# EAGLE design odroid_platine_nerdbot (EAGLE 8.0.1)
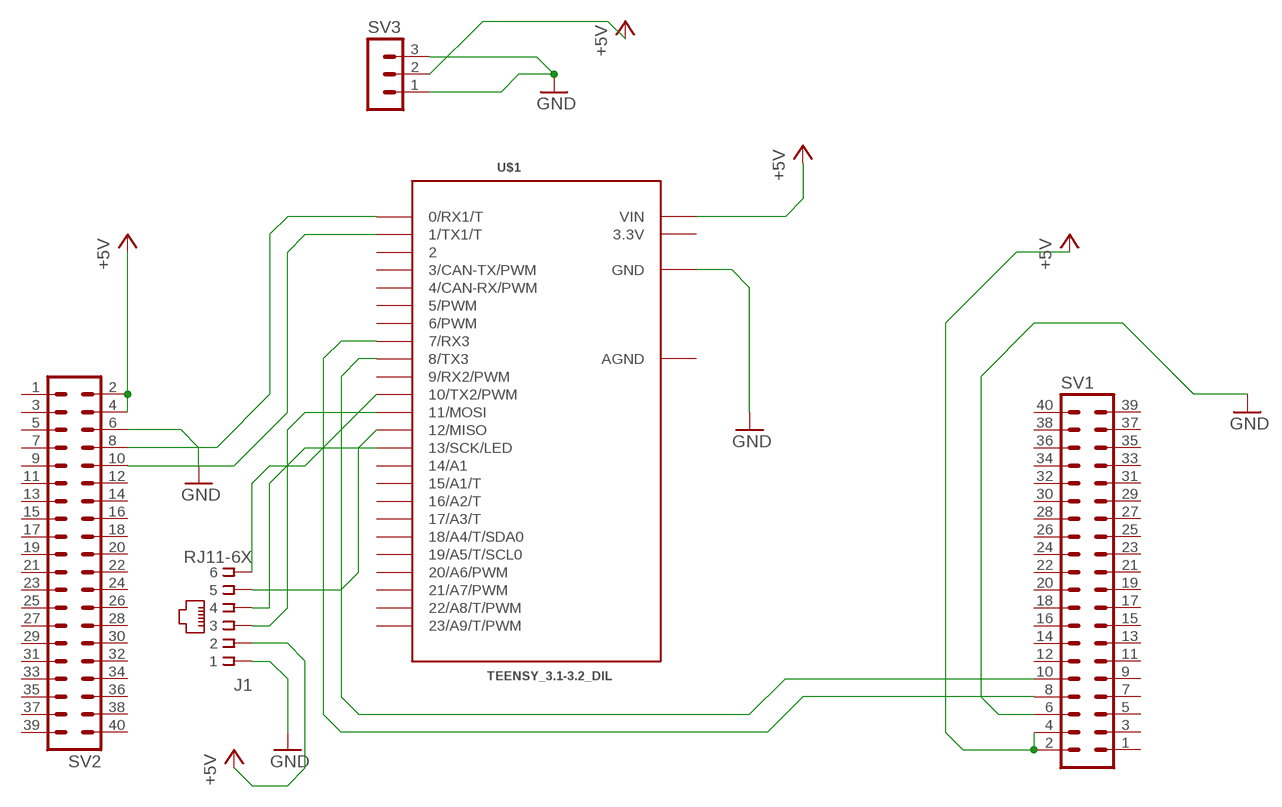
[diagram p0: schematic, sheet 1]

## Parts
J1  RJ11-6X  [RJ11-NO_SHIELD]
SV1  MA20-2  [MA20-2]
SV2  MA20-2  [MA20-2]
SV3  MA03-1  [MA03-1]
U$1  TEENSY_3.1-3.2_DIL  [TEENSY_3.0-3.2&LC_DIL]

## Nets
+5V: J1.2 SV1.2 SV1.4 SV2.2 SV2.4 SV3.2 U$1.VIN
GND: J1.1 SV1.6 SV2.6 SV3.1 SV3.3 U$1.GND
N$1: SV2.8 U$1.0(0/RX1/T)
N$2: SV2.10 U$1.1(1/TX1/T)
N$4: SV1.8 U$1.7(7/RX3)
N$5: SV1.10 U$1.8(8/TX3)
N$6: J1.3 U$1.11(11/MOSI)
N$7: J1.4 U$1.13(13/SCK/LED)
N$8: J1.5 U$1.12(12/MISO)
N$9: J1.6 U$1.10(10/TX2/PWM)
Unconnected: SV1.1 SV1.3 SV1.5 SV1.7 SV1.9 SV1.11 SV1.12 SV1.13 SV1.14 SV1.15 SV1.16 SV1.17 SV1.18 SV1.19 SV1.20 SV1.21 SV1.22 SV1.23 SV1.24 SV1.25 SV1.26 SV1.27 SV1.28 SV1.29 SV1.30 SV1.31 SV1.32 SV1.33 SV1.34 SV1.35 SV1.36 SV1.37 SV1.38 SV1.39 SV1.40 SV2.1 SV2.3 SV2.5 SV2.7 SV2.9 SV2.11 SV2.12 SV2.13 SV2.14 SV2.15 SV2.16 SV2.17 SV2.18 SV2.19 SV2.20 SV2.21 SV2.22 SV2.23 SV2.24 SV2.25 SV2.26 SV2.27 SV2.28 SV2.29 SV2.30 SV2.31 SV2.32 SV2.33 SV2.34 SV2.35 SV2.36 SV2.37 SV2.38 SV2.39 SV2.40 U$1.2 U$1.3(3/CAN-TX/PWM) U$1.4(4/CAN-RX/PWM) U$1.5(5/PWM) U$1.6(6/PWM) U$1.9(9/RX2/PWM) U$1.14/A0(14/A1) U$1.15/A1(15/A1/T) U$1.16/A2(16/A2/T) U$1.17/A3(17/A3/T) U$1.18/A4(18/A4/T/SDA0) U$1.19/A5(19/A5/T/SCL0) U$1.20/A6(20/A6/PWM) U$1.21/A7(21/A7/PWM) U$1.22/A8(22/A8/T/PWM) U$1.23/A9(23/A9/T/PWM)

## Power pins joined to a net without a drawn wire
3.3V: U$1.3.3V
AGND: U$1.AGND

## Library data of the parts
J1 = con-tycoelectronics:RJ11: CORCOM Modular RJ Jacks No Shield Source: www.tycoelectronics.com .. ENG_DS_1654001_1099_RJ_L_0507.pdf; MPN: RJ11-6X; OC_FARNELL: unknown; OC_NEWARK: 16R6089
SV1 SV2 = con-lstb:MA20-2: PIN HEADER; OC_FARNELL: unknown; OC_NEWARK: unknown
SV3 = con-lstb:MA03-1: PIN HEADER; OC_FARNELL: unknown; OC_NEWARK: unknown
U$1 = Teensy_3_and_LC_Series_Boards_v1.4:TEENSY_3.1-3.2_DIL: Teensy 3.1 or 3.2 in a DIL Layout.

## Board
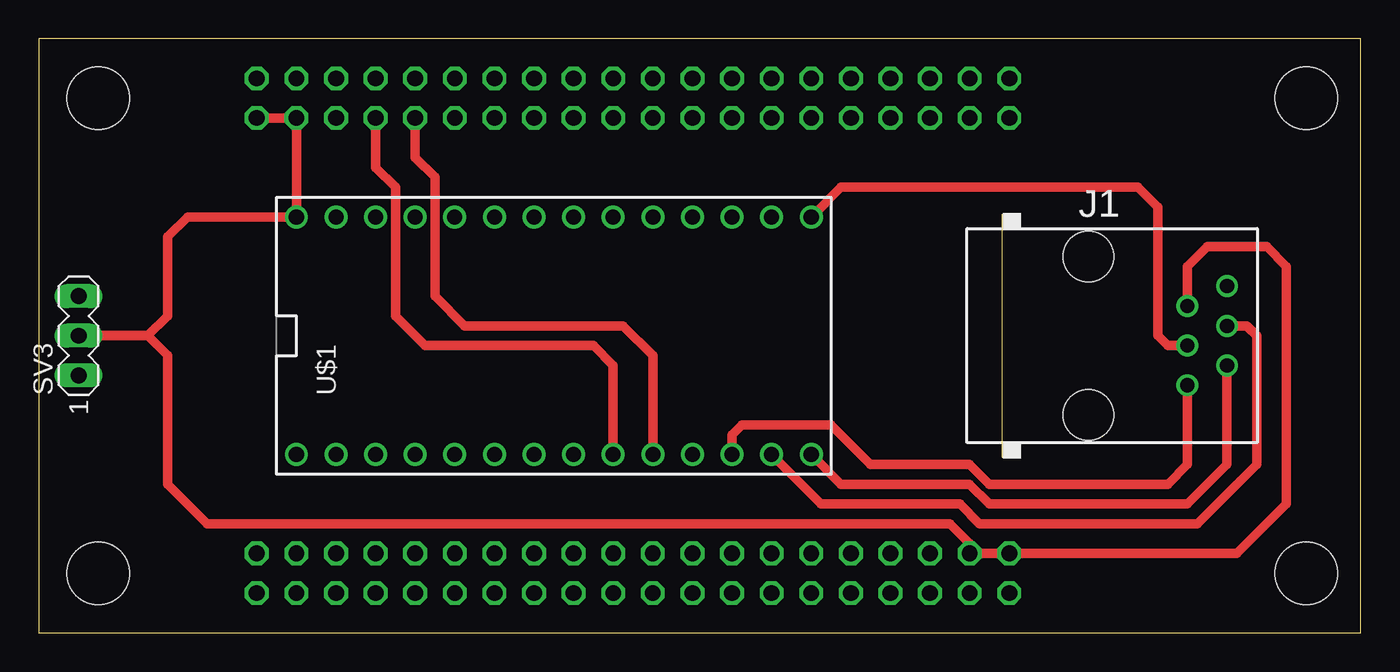
[diagram p1: board, top side]
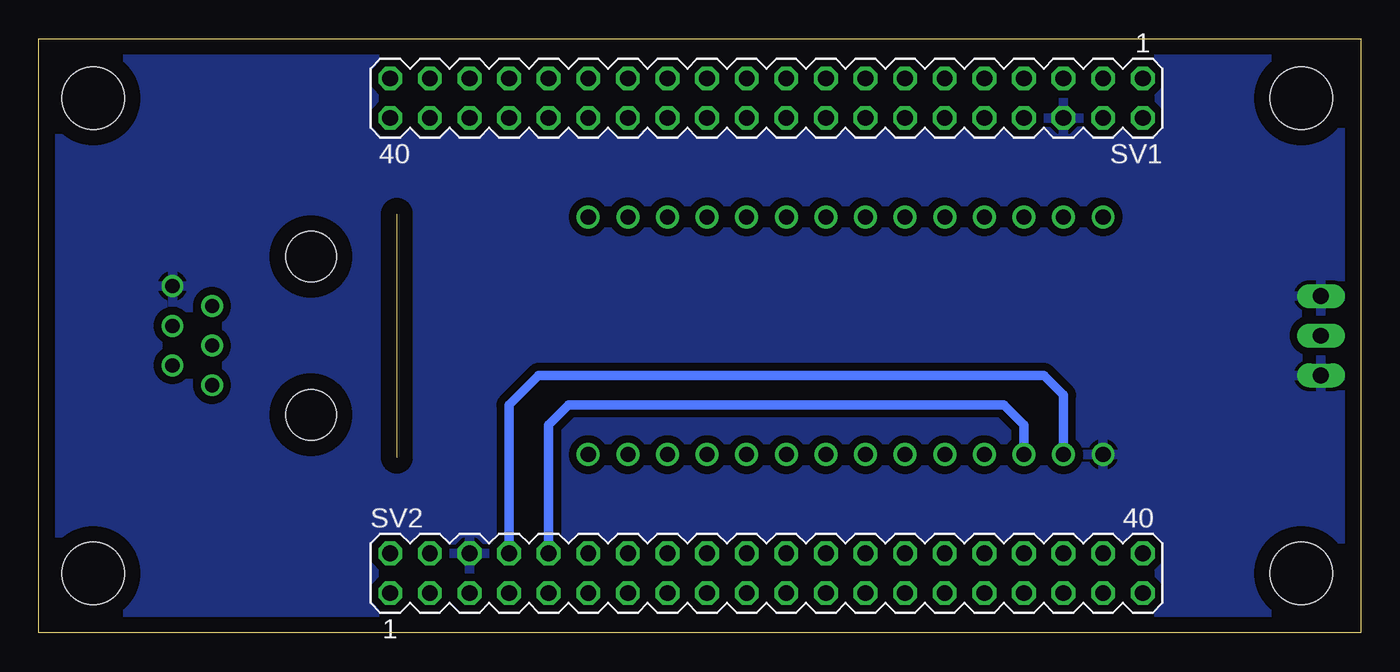
[diagram p2: board, bottom side, seen from below]

Size 84.76 x 38.09 mm. Coordinates in mm from the lower left corner, seen from the top.
Outline: 0,0 84.76,0 84.76,38.09 0,38.09 0,0
Copper layers (1*16): Top 0.035mm / dielectric 1.5mm / Bottom 0.035mm
Design rules "default": minimum track width 10mil, minimum drill 24mil, track to track 8mil, track to pad 8mil, pad to pad 8mil, via to via 8mil, smd to smd 8mil, copper to edge 40mil, drill to drill 8mil, minimum pad ring 10mil, minimum via ring 8mil, stop-mask expansion 4mil, vias tented up to drill 0mil, thermal gap 10mil
Holes 4 mm at 3.81,34.29 3.81,3.81 81.28,34.29 81.28,3.81

### Footprints (pad centres in the part's own frame; a part is rotated, then mirrored left to right if it is on the bottom)
RJ11-NO_SHIELD = drill 0.9 pad 1.4: 1 -3.175,8.89; 2 -1.905,6.35; 3 -0.635,8.89; 4 0.635,6.35; 5 1.905,8.89; 6 3.175,6.35 | hole 3.251: -5.08,0; 5.08,0
MA20-2 = drill 1.016 octagon: 1 -24.13,-1.27; 2 -24.13,1.27; 3 -21.59,-1.27; 4 -21.59,1.27; 5 -19.05,-1.27; 6 -19.05,1.27; 7 -16.51,-1.27; 8 -16.51,1.27; 9 -13.97,-1.27; 10 -13.97,1.27; 11 -11.43,-1.27; 12 -11.43,1.27; 13 -8.89,-1.27; 14 -8.89,1.27; 15 -6.35,-1.27; 16 -6.35,1.27; 17 -3.81,-1.27; 18 -3.81,1.27; 19 -1.27,-1.27; 20 -1.27,1.27; 21 1.27,-1.27; 22 1.27,1.27; 23 3.81,-1.27; 24 3.81,1.27; 25 6.35,-1.27; 26 6.35,1.27; 27 8.89,-1.27; 28 8.89,1.27; 29 11.43,-1.27; 30 11.43,1.27; 31 13.97,-1.27; 32 13.97,1.27; 33 16.51,-1.27; 34 16.51,1.27; 35 19.05,-1.27; 36 19.05,1.27; 37 21.59,-1.27; 38 21.59,1.27; 39 24.13,-1.27; 40 24.13,1.27
MA03-1 = drill 1.016 long: 1 -2.54,0; 2 0,0; 3 2.54,0
TEENSY_3.0-3.2&LC_DIL = drill 0.965: 0 -7.62,13.97; 1 -7.62,11.43; 2 -7.62,8.89; 3 -7.62,6.35; 3.3V 7.62,11.43; 4 -7.62,3.81; 5 -7.62,1.27; 6 -7.62,-1.27; 7 -7.62,-3.81; 8 -7.62,-6.35; 9 -7.62,-8.89; 10 -7.62,-11.43; 11 -7.62,-13.97; 12 -7.62,-16.51; 13 7.62,-16.51; 14/A0 7.62,-13.97; 15/A1 7.62,-11.43; 16/A2 7.62,-8.89; 17/A3 7.62,-6.35; 18/A4 7.62,-3.81; 19/A5 7.62,-1.27; 20/A6 7.62,1.27; 21/A7 7.62,3.81; 22/A8 7.62,6.35; 23/A9 7.62,8.89; AGND 7.62,13.97; GND -7.62,16.51; VIN 7.62,16.51

### Placement (x,y rotation side)
J1  67.31,19.05 270 top
SV1  38.1,34.29 180 bottom
SV2  38.1,3.81 0 bottom
SV3  2.54,19.05 90 top
U$1  33.02,19.05 90 top

### Tracks (layer width: path | path; a pad name or v marks a point on that pad's centre or on a via)
+5V
  Top 0.61: SV3.2 6.98,19.05 | 6.98,19.05 8.25,17.78 8.25,9.53 10.79,6.99 58.42,6.99 59.69,5.71 SV2.4 SV2.2 76.84,5.08 80.01,8.26 80.01,23.5 78.74,24.77 74.93,24.77 73.66,23.5 J1.2 | SV1.2 SV1.4 U$1.VIN 9.52,26.67 8.25,25.4 8.25,20.32 6.98,19.05
GND
  pour Bottom (isolate 0.5): 0.63,37.47 83.82,37.47 83.82,0.64 0.63,0.64
N$1
  Bottom 0.61: U$1.0 19.05,15.24 20.32,16.51 52.7,16.51 54.61,14.61 SV2.8
N$2
  Bottom 0.61: U$1.1 21.59,13.34 22.86,14.61 50.8,14.61 52.07,13.34 SV2.10
N$4
  Top 0.61: U$1.7 36.83,17.14 35.56,18.41 24.76,18.41 22.86,20.32 22.86,28.57 21.59,29.84 SV1.8
N$5
  Top 0.61: U$1.8 39.37,17.78 37.47,19.68 27.31,19.68 25.4,21.59 25.4,29.21 24.13,30.48 SV1.10
N$6
  Top 0.61: J1.3 77.47,19.68 78.11,19.05 78.11,10.79 74.3,6.99 60.33,6.99 59.06,8.26 50.17,8.26 U$1.11
N$7
  Top 0.61: J1.4 72.39,18.41 71.76,19.05 71.76,27.3 70.48,28.57 51.44,28.57 U$1.13
N$8
  Top 0.61: J1.5 76.2,10.79 73.66,8.26 60.96,8.26 59.69,9.53 51.44,9.53 U$1.12
N$9
  Top 0.61: U$1.10 44.45,12.7 45.08,13.34 50.8,13.34 53.34,10.79 59.69,10.79 60.96,9.53 72.39,9.53 73.66,10.79 J1.6